# Altium schematic sheet VoedingBat20V.SchDoc: Voeding Soldeerbout
size A4; DrawnBy: Mangelschots Emiel; SheetNumber: 4; SheetTotal: 5; Parameter 1: /; Parameter 2: 1EAID 12302093
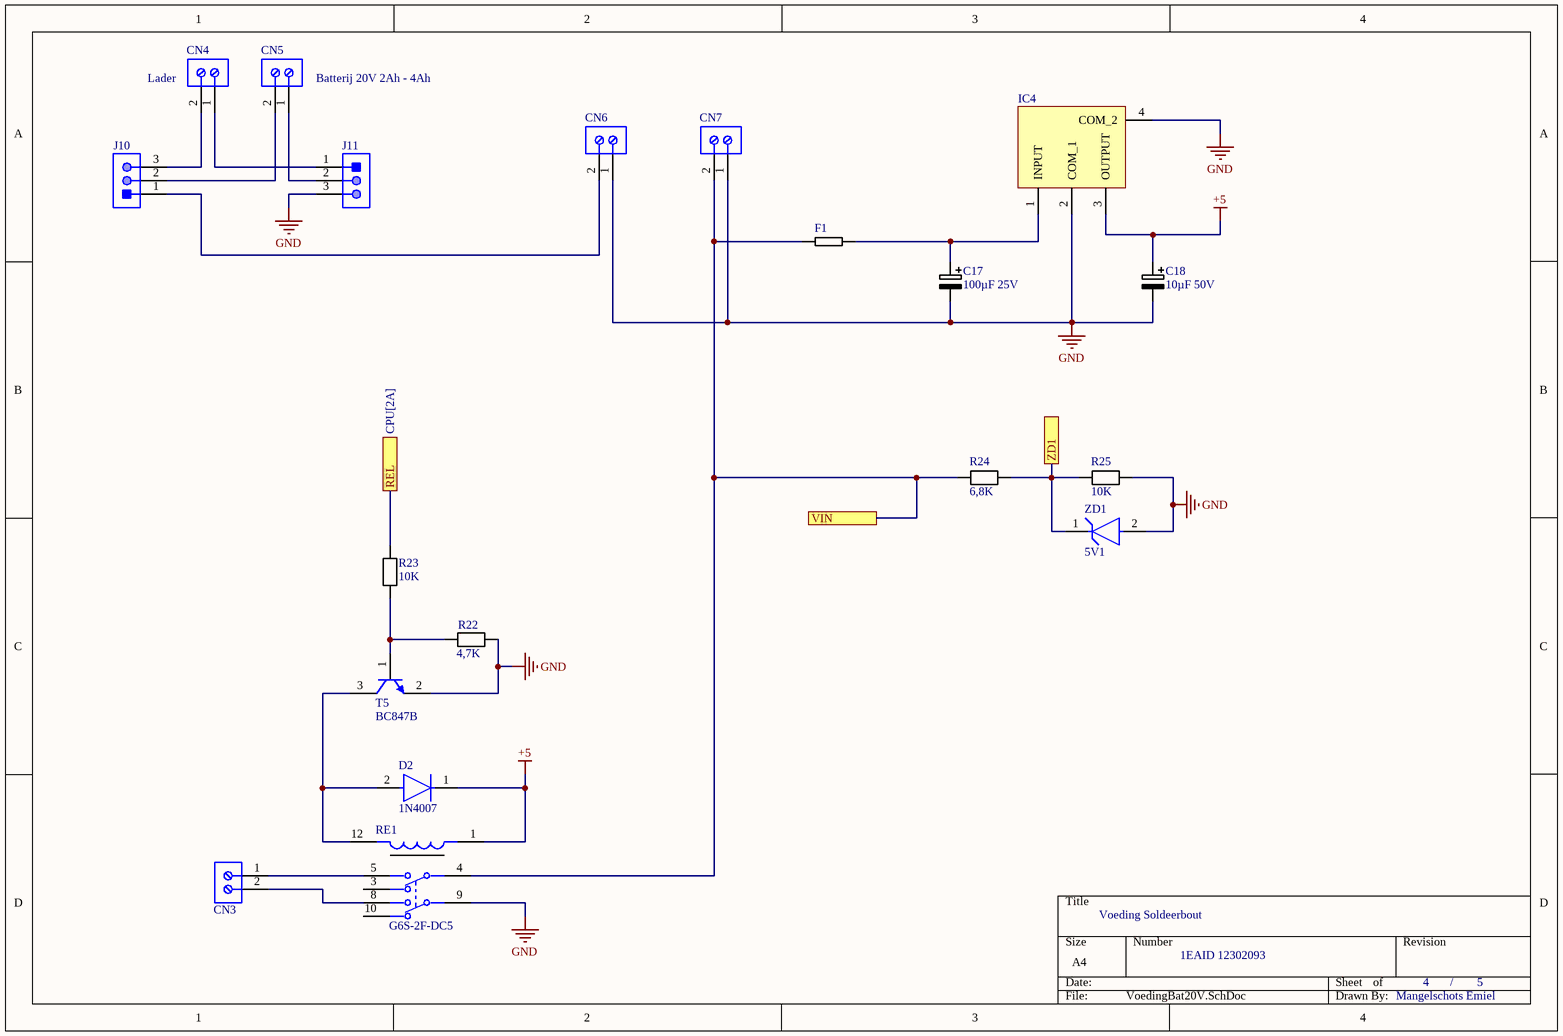
[diagram p0: VoedingBat20V.SchDoc]

## Parts
C17  100µF 25V  [CAPA1]
C18  10µF 50V  [CAPA1]
CN3  1725656  [2 pinHeader]  (value not drawn)
CN4  Lader  [2 pinHeader]
CN5  Batterij 20V 2Ah - 4Ah  [2 pinHeader]
CN6  1725656  [2 pinHeader]  (value not drawn)
CN7  1725656  [2 pinHeader]  (value not drawn)
D2  1N4007  [DIOD]
F1  F1  [F1]  (value not drawn)
IC4  OKI-78SR-5/1.5-W36-C  [SIP625W50P254L1173H771Q4]  (value not drawn)
J10  B3B-PH-K-S(LF)(SN)  [3PinH]  (value not drawn)
J11  B3B-PH-K-S(LF)(SN)  [3PinH]  (value not drawn)
K1  G6S-2F-DC5  [VermogenRelais]
R22  4,7K  [REST]
R23  10K  [REST]
R24  6,8K  [REST]
R25  10K  [REST]
RE1  SmoorSpoel  [Smoorspoel]  (value not drawn)
T5  BC847B  [TRANS]
ZD1  5V1  [ZEN]

## Ports
REL (see CPU[2A]), VIN (see SolBout[2B]), ZD1 (see CPU[4B])

## Nets
+5: C18.1 D2.1(C) IC4.3(OUTPUT) RE1.1
GND: C17.2 C18.2 CN6.1 CN7.1 IC4.2(COM_1) IC4.4(COM_2) J11.3 K1.9 R22.2 R25.2 T5.2(E) ZD1.2(A)
REL: R23.2 ; port REL
VIN: CN7.2 F1.1 K1.4 R24.1 ; port VIN
ZD1: R24.2 R25.1 ZD1.1(C) ; port ZD1
NetC17_1: C17.1 F1.2 IC4.1(INPUT)
NetCN3_1: CN3.1 K1.5
NetCN3_2: CN3.2 K1.8
NetCN4_1: CN4.1 J11.1
NetCN4_2: CN4.2 J10.3
NetCN5_1: CN5.1 J11.2
NetCN5_2: CN5.2 J10.2
NetCN6_2: CN6.2 J10.1
NetD2_2: D2.2(A) RE1.12 T5.3(C)
NetR22_1: R22.1 R23.1 T5.1(B)

Not connected (* = marked no-connect by the designer): K1 3 10

## Library data of the parts
C17 C18 = Capasitor_1: Part Number: GRM1885C1H100JA01D; Manufacturer: Murata
CN3 CN6 CN7 = 2Pin-Header: Manufacturer: Phoenix Contact; Number of contacts: 2; Content: 250pc(s); Pitch: 2.54mm; Industrial packaging: Yes; Colour: Green; Manufacturer part No.: 1725656; Type: MPT0,5/2-2,54; Datasheet URL: http://datasheet.octopart.com/1725656-Phoenix-Contact-datasheet-5302866.pdf; Manufacturer URL: http://www.phoenixcontact.com/; Datasheet Version: Apr-08
CN4 CN5 = 2Pin-Header: Manufacturer part No.: 1725656; Manufacturer: Phoenix Contact; Number of contacts: 2; Content: 250pc(s); Pitch: 2.54mm; Industrial packaging: Yes; Colour: Green; Type: MPT0,5/2-2,54; Datasheet URL: http://datasheet.octopart.com/1725656-Phoenix-Contact-datasheet-5302866.pdf; Manufacturer URL: http://www.phoenixcontact.com/; Datasheet Version: Apr-08
D2 = Diode: 1N4001-E3/54; Max Surge Current: 30A; Forward Voltage: 1.1V; Average Rectified Current: 1A; Voltage: 50V; Capacitance: 15pF; Peak Non-Repetitive Surge Current: 45A; Polarity: Standard; Max Reverse Current: 5uA; Element Configuration: Single; Length: 0.204inch; Diameter: 2.7mm; Mount: Through Hole; Package Quantity: 5500; Series: -; Radiation Hardening: No; Width: 2.7mm; Max Forward Surge Current (Ifsm): 30A; Current Rating: 1A; Height: 2.7mm; Forward Current: 1A; Lead Free: Lead Free; Min Operating Temperature: -50°C; Number of Pins: 2; RoHS Compliant: Yes; Packaging: Tape and Reel; Current: 1A; Max Reverse Voltage (DC): 50V; Output Current: 1A; Reverse Voltage: 50V; Case/Package: DO-204AL; Max Repetitive Reverse Voltage (Vrrm): 50V; Voltage Rating (DC): 50V; Max Operating Temperature: 150°C
IC4 = IC: Manufacturer: Murata; Current - Output (Max): 1.5A; Power (Watts) - Max: 8W; Efficiency: 90.5%; Voltage - Input (Min): 7V; Voltage - Input (Max): 36V; Voltage - Output 1: 5V; Number of Outputs: 1; Package / Case: 3-SIPModule; Features: SCP; Type: LinearRegulatorReplacement; Size / Dimension: 0.41"Lx0.30"Wx0.65"H(10.4mmx7.6mmx16.5mm); Datasheet URL: https://datasheet.ciiva.com/8006/1790439-8006672.pdf; Datasheet Version: Oct-13; Power (Watts) - Manufacture Series: 8W; Voltage - Output 2: -; Series: Okami™OKI-78SR; Family: DCDCConverters; Manufacturer URL: http://www.murata.com/; Category: PowerSupplies-BoardMount; Voltage - Isolation: -; Packaging: Tube; Applications: ITE(Commercial); Mounting Type: ThroughHole; Voltage - Output 3: -; Operating Temperature: -40degC~85degC
J10 J11 = 3Pin-Header: Manufacturer: JST; Style/Orientation: StraightHeader/Plug; Pitch: 2mm; No of Positions: 3; Termination: Crimp; Manufacturer URL: http://www.jst.com/home2.html; Datasheet Version: Oct-06; Type: ShroudedHeader; Datasheet URL: https://datasheet.ciiva.com/11746/0900766b80826550-11746939.pdf
K1 = VermogenRelais: Manufacturer Part Number: RT424005; Manufacturer: TE Connectivity; Coil Power: 403mW; Throw Configuration: DPDT; Coil Voltage: 5V; Number Of Contacts: 2; Coil Resistance: 62Ω; Current Rating: 8A; Coil Type: Non-Latching; Category: Relay; Octopart: https://octopart.com/5-1393243-9-te+connectivity-41835766; Device Class L3: Power Relays; ComponentLink2URL: https://www.te.com/commerce/DocumentDelivery/DDEController?Action=showdoc&DocId=Data+Sheet%7FRT2%7F1014%7Fpdf%7FEnglish%7FENG_DS_RT2_1014.pdf%7F5-1393243-9; Ambient Temperature Range High: +85°C; ComponentLink2Description: Datasheet; Digikey Description: RELAY GENERAL PURPOSE DPDT 8A 5V; Package: RT424005; Automotive: No; Device Class L1: Electromechanical; Height: 15.7mm; Device Class L2: Relays; Ambient Temperature Range Low: -40°C; Mouser Description: General Purpose Relay, Rt2 Series, Power, Non Latching, Dpdt, 5 Vdc, 8 A Rohs Compliant: Yes; Lead Free: Yes; RoHS: TRUE
R22-R25 = resistor: Manufacturer: Vishay Dale; Part Number: CRCW08050000Z0EA
RE1 = SmoorSpoel: Surface Mount High Frequency Inductor, NLV Series, 10 H, 5%, 1008 [2520 Metric], 33 MHz, 3.5 ohm NLV25T-100J-EF; MF: TDK; Availability: In Stock; Purchase-URL: https://pricing.snapeda.com/search/part/NLV25T-100J-EF/?ref=eda; SnapEDA_Link: https://www.snapeda.com/parts/NLV25T-100J-EF/TDK/view-part/?ref=snap; MP: NLV25T-100J-EF; Price: None; Package: SMD-2 TDK; Value: *; Check_prices: https://www.snapeda.com/parts/NLV25T-100J-EF/TDK/view-part/?ref=eda
T5 = Transistor: Manufacturer: On Semiconductor; PartNumber: BC547C; IC Continuous (A): 0.1; fT Min (MHz): 150; Packing: Bulk Box; Polarity: NPN; Mounting Technology: Through Hole; ComponentLink1URL: http://www.onsemi.com/; ComponentLink1Description: Manufacturer URL; ComponentLink3URL: http://www.onsemi.cn/pub_link/Collateral/2N6426-D.PDF; DatasheetVersion: Rev. 7; PackageVersion: Rev. AM; RoHS: FALSE; ComponentLink2URL: http://www.onsemi.com/pub_link/Collateral/BC546-D.PDF; ComponentLink3Description: Package Specification; PackageDescription: 3-Pin Transistor Outline, Body 4.825 x 3.685 mm, Pitch 1.27 mm; PackageReference: TO-92-3-29-11_AM_SL; ComponentLink2Description: Datasheet
ZD1 = Zenerdiode